# Altium project Pet_Tracker_Board_Test.PrjPcb
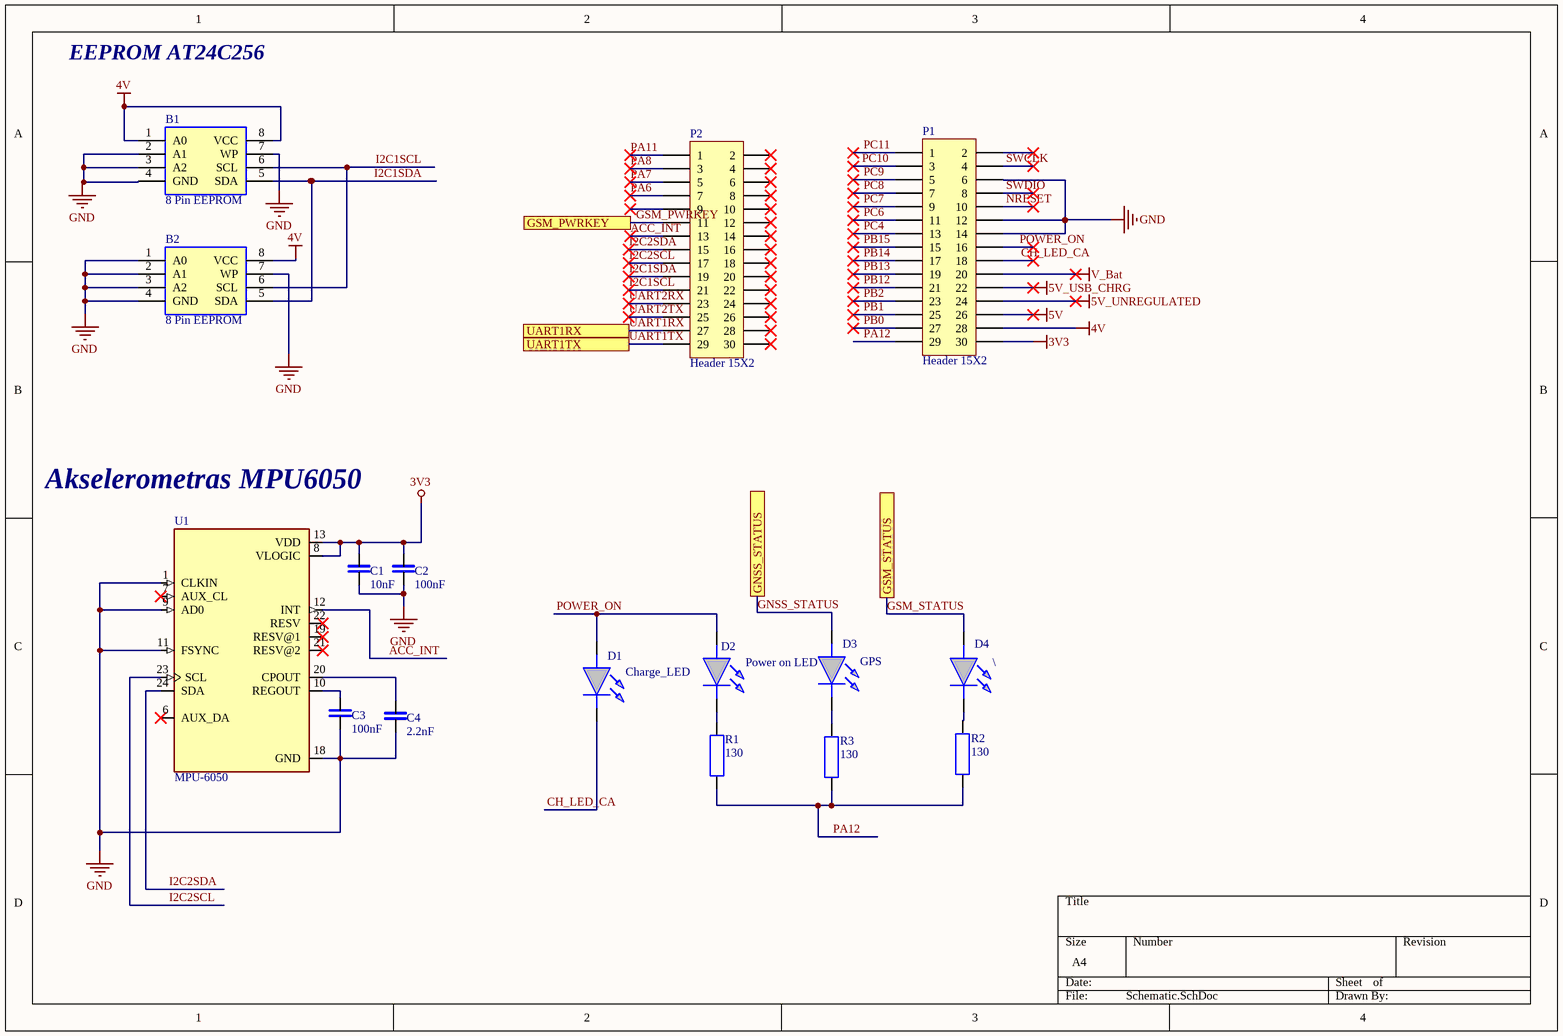
[diagram p0: Schematic.SchDoc]
2 sheets, 27 parts. Net scope: flat (ports and power ports of the same name join across sheets).
Board file: Pet_Tracker_PCB.PcbDoc
Sheets:
  Schematic.SchDoc
  Modem.SchDoc

## Sheet Schematic.SchDoc
size A4; SheetNumber: 1; SheetTotal: 2

### Parts
B1  8 Pin EEPROM  [AT24C256]
B2  8 Pin EEPROM  [AT24C256]
C1  10nF  [CAP_0805]
C2  100nF  [CAP_0805]
C3  100nF  [CAP_0805]
C4  2.2nF  [CAP_0805]
D1  Charge_LED  [LED_0805]
D2  Power on LED  [LED_0805]
D3  GPS  [LED_0805]
D4  \  [LED_0805]
P1  Header 15X2  [HDR2X15]
P2  Header 15X2  [HDR2X15]
R1  130  [RES_0805]
R2  130  [RES_0805]
R3  130  [RES_0805]
U1  MPU-6050  [MPU_6050]

### Ports
GNSS_STATUS, GSM_PWRKEY, GSM_STATUS, UART1RX, UART1TX

### Nets
3V3: C1.2 C2.2 P1.30 U1.8(VLOGIC) U1.13(VDD)
4V: B1.1(A0) B1.8(VCC) B2.8(VCC) P1.28
5V: P1.26
5V_UNREGULATED: P1.24
5V_USB_CHRG: P1.22
GND: B1.2(A1) B1.3(A2) B1.4(GND) B1.7(WP) B2.1(A0) B2.2(A1) B2.3(A2) B2.4(GND) B2.7(WP) C1.1 C2.1 C3.1 C4.1 P1.6 P1.12 P1.14 U1.1(CLKIN) U1.9(AD0) U1.11(FSYNC) U1.18(GND)
V_Bat: P1.20
ACC_INT: P2.13 U1.12(INT)
CH_LED_CA: D1.1(K) P1.18
GNSS_STATUS: D3.2(A) ; port GNSS_STATUS
GSM_PWRKEY: P2.11 ; port GSM_PWRKEY
GSM_STATUS: D4.2(A) ; port GSM_STATUS
I2C1SCL: B1.6(SCL) B2.6(SCL) P2.21
I2C1SDA: B1.5(SDA) B2.5(SDA) P2.19
I2C2SCL: P2.17 U1.23(SCL)
I2C2SDA: P2.15 U1.24(SDA)
NRESET: P1.10
PA6: P2.7
PA7: P2.5
PA8: P2.3
PA11: P2.1
PA12: P1.29 R1.1 R2.1 R3.1
PB0: P1.27
PB1: P1.25
PB2: P1.23
PB12: P1.21
PB13: P1.19
PB14: P1.17
PB15: P1.15
PC4: P1.13
PC6: P1.11
PC7: P1.9
PC8: P1.7
PC9: P1.5
PC10: P1.3
PC11: P1.1
POWER_ON: D1.2(A) D2.2(A) P1.16
SWCLK: P1.4
SWDIO: P1.8
UART1RX: P2.27 ; port UART1RX
UART1TX: P2.29 ; port UART1TX
UART2RX: P2.23
UART2TX: P2.25
NetC3_2: C3.2 U1.10(REGOUT)
NetC4_2: C4.2 U1.20(CPOUT)
NetD2_1: D2.1(K) R1.2
NetD3_1: D3.1(K) R3.2
NetD4_1: D4.1(K) R2.2

Not connected (* = marked no-connect by the designer): P1 2*; P2 2* 4* 6* 8* 9* 10* 12* 14* 16* 18* 20* 22* 24* 26* 28* 30*; U1 6(AUX_DA)* 7(AUX_CL)* 19(RESV@1)* 21(RESV@2)* 22(RESV)*

### Notes on the sheet
- EEPROM AT24C256
- Akselerometras MPU6050

### Library data of the parts
B1 B2 = AT24C256C: EEPROM 256K (32K X 8), 2-WI 1.8V / https://lt.farnell.com/microchip/at24c256c-sshl-t/serial-eeprom-256kbit-1mhz-soic/dp/2345588?st=AT24C256|; Geometry.Height: 1.75mm; Manufacturer_Name: Microchip; Manufacturer_Part_Number: AT24C256C-SSHL-T; Mouser Part Number: 556-AT24C256C-SSHL-T; Mouser Price/Stock: https://www.mouser.co.uk/ProductDetail/Microchip-Technology/AT24C256C-SSHL-T?qs=fzsaQExJLyR3ptk4tHE3tA%3D%3D; Arrow Part Number: AT24C256C-SSHL-T; Arrow Price/Stock: https://www.arrow.com/en/products/at24c256c-sshl-t/microchip-technology?region=nac; Datasheet Link: http://www.atmel.com/Images/Atmel-8568-SEEPROM-AT24C256C-Datasheet.pdf
C1-C4 = SMT_CAP: MP: LD051A270KAB2A; Package: None; Price: None; Availability: Unavailable
D1-D4 = LED: PART: MULTICOMP PRO MP008291LED / https://lt.farnell.com/multicomp-pro/mp008291/led-green-70mcd-576nm-0805/dp/3796323?st=smt%20led; Manufacturer_Name: Avago Technologies; Manufacturer_Part_Number: HSMH-C170; Geometry.Height: 0.9mm; Mouser Part Number: 630-HSMH-C170; Mouser Price/Stock: https://www.mouser.co.uk/ProductDetail/Broadcom-Avago/HSMH-C170?qs=YDL0qNrpDT6b21G9HrN9ig%3D%3D; Arrow Part Number: *; Arrow Price/Stock: *; Datasheet Link: https://docs.broadcom.com/docs/AV02-0551EN
P1 P2 = Header 15X2: Header, 15-Pin, Dual row; LatestRevisionDate: 17-Jul-2002; LatestRevisionNote: Re-released for DXP Platform.; Publisher: Altium Limited
R1-R3 = SMT_RES: Power_Rating: .25 W; MP: 2-2176053-0; Tolerance: 1%; Resistance: .33; MF: TE Connectivity; Price: None; Availability: In Stock; EU_RoHS_Compliance: Compliant with Exemptions; Package: 0805; Value: *; SnapEDA_Link: https://www.snapeda.com/parts/2-2176053-0/TE+Connectivity/view-part/?ref=snap; Check_prices: https://www.snapeda.com/parts/2-2176053-0/TE+Connectivity/view-part/?ref=eda
U1 = MPU-6050: MPU-6050 series Accelerometer, Gyroscope, 3 Axis Sensor Evaluation Board / https://lt.farnell.com/invensense/mpu-6050/gyro-accel-6-axis-i2c-qfn-24/dp/1864742; MF: TDK InvenSense; Value: *; SnapEDA_Link: https://www.snapeda.com/parts/MPU-6050/TDK+InvenSense/view-part/?ref=snap; Purchase-URL: https://pricing.snapeda.com/search/part/MPU-6050/?ref=eda; Availability: In Stock; Price: None; Package: QFN-24 InvenSense; Check_prices: https://www.snapeda.com/parts/MPU-6050/TDK+InvenSense/view-part/?ref=eda; MP: MPU-6050

## Sheet Modem.SchDoc
size A4; SheetNumber: 2; SheetTotal: 2
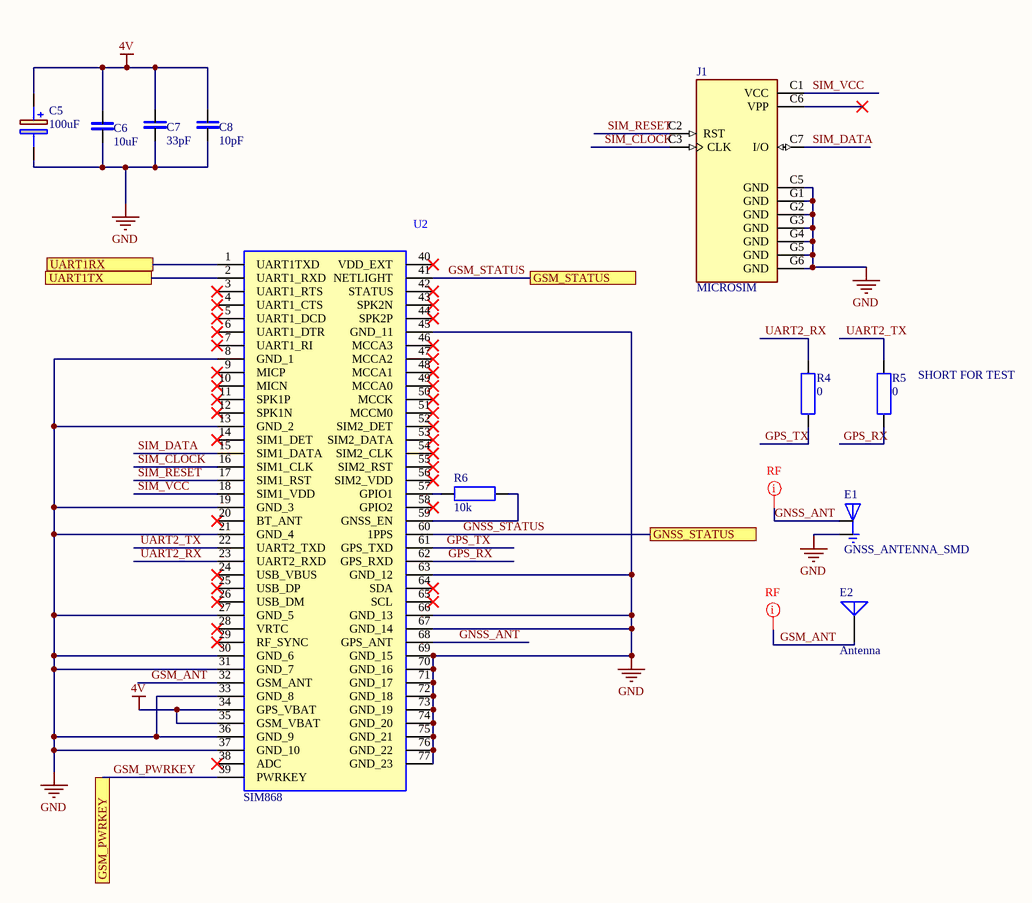
[diagram p1: Modem.SchDoc]

### Parts
C5  100uF  [TANTALUM_CAP_0805]
C6  10uF  [CAP_0805]
C7  33pF  [CAP_0805]
C8  10pF  [CAP_0805]
E1  GNSS_ANTENNA_SMD  [GNSS_ANTENNA_SMD]
E2  Antenna  [PIN1]
J1  MICROSIM  [MICROSIM]
R4  0  [RES_0805]
R5  0  [RES_0805]
R6  10k  [RES_0805]
U2  GPRS,GSM,GNSS Modem  [SIM868]  (value not drawn)

### Ports
GNSS_STATUS, GSM_PWRKEY, GSM_STATUS, UART1RX, UART1TX

### Nets
4V: C5.1(+) C6.2 C7.2 C8.2 U2.34(GPS_VBAT) U2.35(GSM_VBAT)
GND: C5.2(-) C6.1 C7.1 C8.1 E1.2(GND) J1.C5(GND) J1.G1(GND) J1.G2(GND) J1.G3(GND) J1.G4(GND) J1.G5(GND) J1.G6(GND) U2.8(GND_1) U2.13(GND_2) U2.19(GND_3) U2.21(GND_4) U2.27(GND_5) U2.30(GND_6) U2.31(GND_7) U2.33(GND_8) U2.36(GND_9) U2.37(GND_10) U2.45(GND_11) U2.63(GND_12) U2.66(GND_13) U2.67(GND_14) U2.69(GND_15) U2.70(GND_16) U2.71(GND_17) U2.72(GND_18) U2.73(GND_19) U2.74(GND_20) U2.75(GND_21) U2.76(GND_22) U2.77(GND_23)
GNSS_ANT: E1.1(FEEDING) U2.68(GPS_ANT)
GNSS_STATUS: U2.60(1PPS) ; port GNSS_STATUS
GPS_RX: R5.1 U2.62(GPS_RXD)
GPS_TX: R4.1 U2.61(GPS_TXD)
GSM_ANT: E2.1(A) U2.32(GSM_ANT)
GSM_PWRKEY: U2.39(PWRKEY) ; port GSM_PWRKEY
GSM_STATUS: U2.41(NETLIGHT) ; port GSM_STATUS
SIM_CLOCK: J1.C3(CLK) U2.16(SIM1_CLK)
SIM_DATA: J1.C7(I/O) U2.15(SIM1_DATA)
SIM_RESET: J1.C2(RST) U2.17(SIM1_RST)
SIM_VCC: J1.C1(VCC) U2.18(SIM1_VDD)
UART1RX: U2.1(UART1TXD) ; port UART1RX
UART1TX: U2.2(UART1_RXD) ; port UART1TX
UART2_RX: R4.2 U2.23(UART2_RXD)
UART2_TX: R5.2 U2.22(UART2_TXD)
NetR6_1: R6.1 U2.57(GPIO1)
NetR6_2: R6.2 U2.59(GNSS_EN)

Not connected (* = marked no-connect by the designer): J1 C6(VPP)*; U2 3(UART1_RTS)* 4(UART1_CTS)* 5(UART1_DCD)* 6(UART1_DTR)* 7(UART1_RI)* 9(MICP)* 10(MICN)* 11(SPK1P)* 12(SPK1N)* 14(SIM1_DET)* 20(BT_ANT)* 24(USB_VBUS)* 25(USB_DP)* 26(USB_DM)* 28(VRTC)* 29(RF_SYNC)* 38(ADC)* 40(VDD_EXT)* 42(STATUS)* 43(SPK2N)* 44(SPK2P)* 46(MCCA3)* 47(MCCA2)* 48(MCCA1)* 49(MCCA0)* 50(MCCK)* 51(MCCM0)* 52(SIM2_DET)* 53(SIM2_DATA)* 54(SIM2_CLK)* 55(SIM2_RST)* 56(SIM2_VDD)* 58(GPIO2)* 64(SDA)* 65(SCL)*

### Layout directives
net class RF: GNSS_ANT, GSM_ANT

### Notes on the sheet
- (near R5) SHORT FOR TEST

### Library data of the parts
C5 = SMT_TANTALUM_CAP: T491C107K016AT; Manufacturer_Name: KEMET; Geometry.Height: 2.8mm; Manufacturer_Part_Number: T491C107K016AT; Mouser Part Number: 80-T491C107K016AT; Mouser Price/Stock: https://www.mouser.co.uk/ProductDetail/KEMET/T491C107K016AT?qs=Si2vDv5E4YMke5HCn79NYA%3D%3D; Arrow Part Number: T491C107K016AT; Arrow Price/Stock: https://www.arrow.com/en/products/t491c107k016at/kemet-corporation?region=nac; Datasheet Link: https://content.kemet.com/datasheets/KEM_T2005_T491.pdf
C6-C8 = SMT_CAP: MP: LD051A270KAB2A; Package: None; Price: None; Availability: Unavailable
E1 = GNSS_ANTENNA_SMD: Ceramic GNSS antenna 25*25 SMD; MF: Linx; MP: ANT-GNSSCP-TH18L1; Value: *; SnapEDA_Link: https://www.snapeda.com/parts/ANT-GNSSCP-TH18L1/Linx/view-part/?ref=snap; Purchase-URL: https://pricing.snapeda.com/search/part/ANT-GNSSCP-TH18L1/?ref=eda; Availability: In Stock; Price: None; Package: None; Check_prices: https://www.snapeda.com/parts/ANT-GNSSCP-TH18L1/Linx/view-part/?ref=eda
E2 = Antenna: Generic Antenna; Published: 24-Mar-1999; LatestRevisionDate: 17-Jul-2002; LatestRevisionNote: Re-released for DXP Platform.; PackageReference: PIN1; Publisher: Altium Limited
J1 = MICROSIM: PART NR: 78646-3001; MF: Molex; Check_prices: https://www.snapeda.com/parts/78646-3001/Molex/view-part/?ref=eda; Value: *; Availability: In Stock; MP: 78646-3001; Price: None; Package: None; SnapEDA_Link: https://www.snapeda.com/parts/78646-3001/Molex/view-part/?ref=snap
R4-R6 = SMT_RES: as R1 on sheet Schematic; Price: None; Availability: In Stock; EU_RoHS_Compliance: Compliant with Exemptions; Package: 0805; Value: *; SnapEDA_Link: https://www.snapeda.com/parts/2-2176053-0/TE+Connectivity/view-part/?ref=snap; Check_prices: https://www.snapeda.com/parts/2-2176053-0/TE+Connectivity/view-part/?ref=eda
U2 = SIM868: Manufacturer_Name: SIMCOM; GateName_1: G$1; LibraryName: SIM868; DeviceSetName: SIM868; Package: SIM868; Manufacturer_Part_Number: SIM868; Height: mm; SymbolName_1: SIM868

## Nets that join several sheets
4V: Schematic (B1.1 B1.8 B2.8 P1.28), Modem (6 pins)
GND: Schematic (20 pins), Modem (35 pins)
GNSS_STATUS: Schematic (D3.2), Modem (U2.60)
GSM_PWRKEY: Schematic (P2.11), Modem (U2.39)
GSM_STATUS: Schematic (D4.2), Modem (U2.41)
UART1RX: Schematic (P2.27), Modem (U2.1)
UART1TX: Schematic (P2.29), Modem (U2.2)